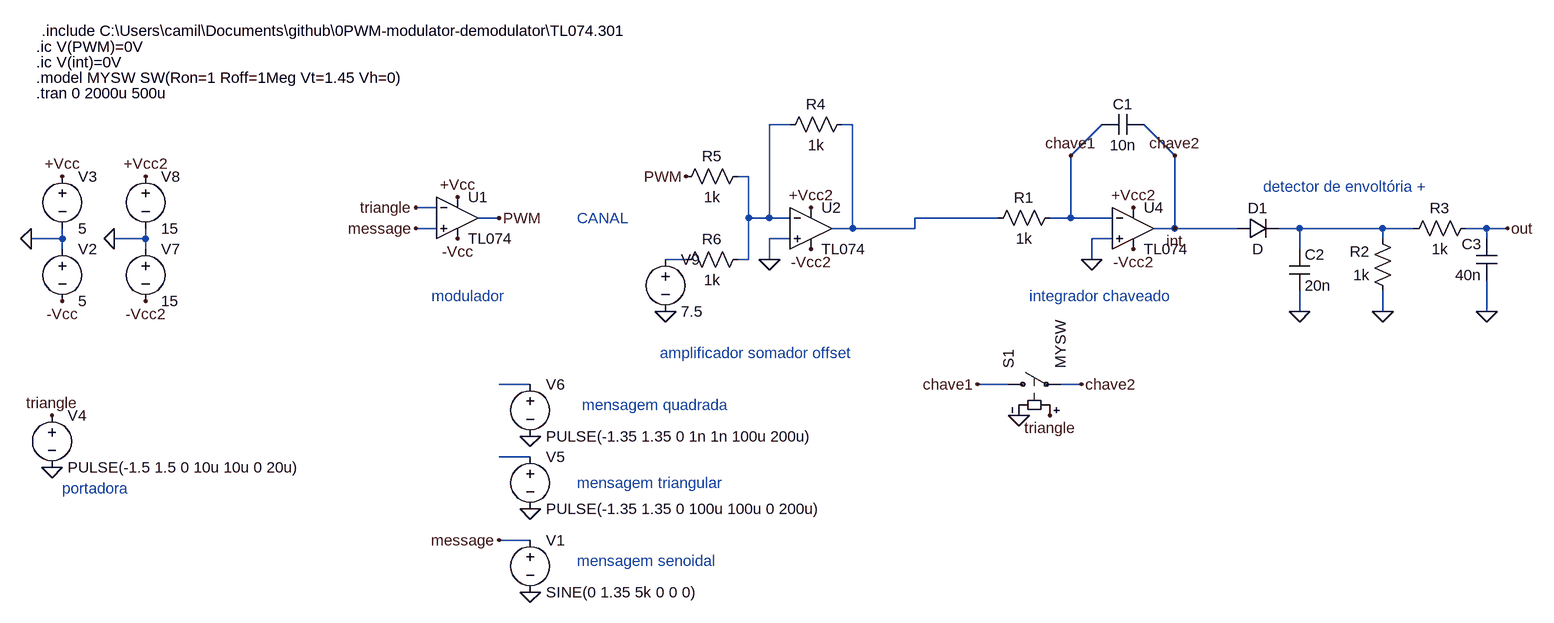
[diagram p0: schematic PWM.asc]
PWM.asc, the LTspice schematic file:
Version 4
SHEET 1 2504 684
WIRE 576 -208 544 -208
WIRE 672 -208 656 -208
WIRE 1008 -160 1056 -208
WIRE 1168 -160 1120 -208
WIRE 512 -128 496 -128
WIRE 32 -80 0 -80
WIRE 128 -64 96 -64
WIRE 512 -64 512 -128
WIRE 544 -64 544 -208
WIRE 544 -64 512 -64
WIRE 576 -64 544 -64
WIRE 896 -64 768 -64
WIRE 1008 -64 1008 -160
WIRE 1008 -64 976 -64
WIRE 1072 -64 1008 -64
WIRE 32 -48 0 -48
WIRE 672 -48 672 -208
WIRE 672 -48 640 -48
WIRE 768 -48 768 -64
WIRE 768 -48 672 -48
WIRE 1168 -48 1168 -160
WIRE 1168 -48 1136 -48
WIRE 1264 -48 1168 -48
WIRE 1360 -48 1328 -48
WIRE 1488 -48 1360 -48
WIRE 1536 -48 1488 -48
WIRE 1648 -48 1616 -48
WIRE 1680 -48 1648 -48
WIRE -544 -32 -544 -48
WIRE -544 -32 -592 -32
WIRE -416 -32 -416 -48
WIRE -416 -32 -464 -32
WIRE 576 -32 544 -32
WIRE 1072 -32 1040 -32
WIRE 1488 -32 1488 -48
WIRE 1648 -32 1648 -48
WIRE -544 -16 -544 -32
WIRE -416 -16 -416 -32
WIRE 1360 -16 1360 -48
WIRE 416 0 384 0
WIRE 512 0 512 -64
WIRE 512 0 496 0
WIRE 544 0 544 -32
WIRE 1040 0 1040 -32
WIRE 1360 80 1360 48
WIRE 1488 80 1488 48
WIRE 1648 80 1648 32
WIRE 176 192 128 192
WIRE 912 192 864 192
WIRE 1024 192 992 192
WIRE 176 304 128 304
WIRE 176 432 128 432
FLAG -592 -32 0
FLAG -544 -128 +Vcc
FLAG 64 -96 +Vcc
FLAG -544 64 -Vcc
FLAG 64 -32 -Vcc
FLAG 176 512 0
FLAG 0 -80 triangle
FLAG 128 -64 PWM
FLAG -560 320 0
FLAG -560 240 triangle
FLAG 0 -48 message
FLAG 176 384 0
FLAG 128 432 message
FLAG 1104 -80 +Vcc2
FLAG 1104 -16 -Vcc2
FLAG 1040 0 0
FLAG 416 -128 PWM
FLAG 1168 -48 int
FLAG 928 240 0
FLAG 976 240 triangle
FLAG 176 272 0
FLAG -464 -32 0
FLAG -416 -128 +Vcc2
FLAG -416 64 -Vcc2
FLAG 1360 80 0
FLAG 1488 80 0
FLAG 608 -80 +Vcc2
FLAG 608 -16 -Vcc2
FLAG 544 0 0
FLAG 1680 -48 out
FLAG 1008 -160 chave1
FLAG 1168 -160 chave2
FLAG 864 192 chave1
FLAG 1024 192 chave2
FLAG 384 80 0
FLAG 1648 80 0
SYMBOL voltage -544 -32 R0
WINDOW 123 0 0 Left 0
WINDOW 39 0 0 Left 0
SYMATTR InstName V2
SYMATTR Value 5
SYMBOL voltage -544 -144 R0
WINDOW 123 0 0 Left 0
WINDOW 39 0 0 Left 0
SYMATTR InstName V3
SYMATTR Value 5
SYMBOL voltage 176 416 R0
WINDOW 123 0 0 Left 0
WINDOW 39 0 0 Left 0
SYMATTR InstName V1
SYMATTR Value SINE(0 1.35 5k 0 0 0)
SYMBOL voltage -560 224 R0
WINDOW 123 0 0 Left 0
WINDOW 39 0 0 Left 0
SYMATTR InstName V4
SYMATTR Value PULSE(-1.5 1.5 0 10u 10u 0 20u)
SYMBOL voltage 176 288 R0
WINDOW 123 0 0 Left 0
WINDOW 39 0 0 Left 0
SYMATTR InstName V5
SYMATTR Value PULSE(-1.35 1.35 0 100u 100u 0 200u)
SYMBOL res 992 -80 R90
WINDOW 0 0 56 VBottom 2
WINDOW 3 32 56 VTop 2
SYMATTR InstName R1
SYMATTR Value 1k
SYMBOL cap 1120 -224 R90
WINDOW 0 0 32 VBottom 2
WINDOW 3 32 32 VTop 2
SYMATTR InstName C1
SYMATTR Value 10n
SYMBOL sw 896 192 R270
SYMATTR InstName S1
SYMATTR Value MYSW
SYMBOL voltage 176 176 R0
WINDOW 123 0 0 Left 0
WINDOW 39 0 0 Left 0
SYMATTR InstName V6
SYMATTR Value PULSE(-1.35 1.35 0 1n 1n 100u 200u)
SYMBOL voltage -416 -32 R0
WINDOW 123 0 0 Left 0
WINDOW 39 0 0 Left 0
SYMATTR InstName V7
SYMATTR Value 15
SYMBOL voltage -416 -144 R0
WINDOW 123 0 0 Left 0
WINDOW 39 0 0 Left 0
SYMATTR InstName V8
SYMATTR Value 15
SYMBOL res 1504 64 R180
WINDOW 0 36 76 Left 2
WINDOW 3 36 40 Left 2
SYMATTR InstName R2
SYMATTR Value 1k
SYMBOL cap 1344 -16 R0
SYMATTR InstName C2
SYMATTR Value 20n
SYMBOL diode 1264 -32 R270
WINDOW 0 32 32 VTop 2
WINDOW 3 0 32 VBottom 2
SYMATTR InstName D1
SYMBOL res 672 -224 R90
WINDOW 0 0 56 VBottom 2
WINDOW 3 32 56 VTop 2
SYMATTR InstName R4
SYMATTR Value 1k
SYMBOL res 512 -144 R90
WINDOW 0 0 56 VBottom 2
WINDOW 3 32 56 VTop 2
SYMATTR InstName R5
SYMATTR Value 1k
SYMBOL res 512 -16 R90
WINDOW 0 0 56 VBottom 2
WINDOW 3 32 56 VTop 2
SYMATTR InstName R6
SYMATTR Value 1k
SYMBOL voltage 384 -16 R0
WINDOW 123 0 0 Left 0
WINDOW 39 0 0 Left 0
SYMATTR InstName V9
SYMATTR Value 7.5
SYMBOL res 1632 -64 R90
WINDOW 0 0 56 VBottom 2
WINDOW 3 32 56 VTop 2
SYMATTR InstName R3
SYMATTR Value 1k
SYMBOL cap 1664 32 R180
WINDOW 0 24 56 Left 2
WINDOW 3 24 8 Left 2
SYMATTR InstName C3
SYMATTR Value 40n
SYMBOL OpAmps\\opamp2 64 -128 R0
SYMATTR InstName U1
SYMATTR Value TL074
SYMBOL OpAmps\\opamp2 608 -112 R0
SYMATTR InstName U2
SYMATTR Value TL074
SYMBOL OpAmps\\opamp2 1104 -112 R0
SYMATTR InstName U4
SYMATTR Value TL074
TEXT -584 -256 Left 2 !.tran 0 2000u 500u
TEXT -584 -304 Left 2 !.ic V(int)=0V
TEXT -584 -280 Left 2 !.model MYSW SW(Ron=1 Roff=1Meg Vt=1.45 Vh=0)
TEXT 24 56 Left 2 ;modulador
TEXT 248 -64 Left 2 ;CANAL
TEXT 944 56 Left 2 ;integrador chaveado
TEXT 1304 -112 Left 2 ;detector de envoltória +
TEXT -544 352 Left 2 ;portadora
TEXT 256 224 Left 2 ;mensagem quadrada
TEXT 248 344 Left 2 ;mensagem triangular
TEXT 248 464 Left 2 ;mensagem senoidal
TEXT 376 144 Left 2 ;amplificador somador offset
TEXT -584 -328 Left 2 !.ic V(PWM)=0V
TEXT -576 -352 Left 2 !.include C:\\Users\\camil\\Documents\\github\\0PWM-modulator-demodulator\\TL074.301

The netlist it stands for:
* PWM.asc
V2 0 -Vcc 5
V3 +Vcc 0 5
V1 message 0 SINE(0 1.35 5k 0 0 0)
V4 triangle 0 PULSE(-1.5 1.5 0 10u 10u 0 20u)
V5 N006 0 PULSE(-1.35 1.35 0 100u 100u 0 200u)
R1 chave1 N002 1k
C1 chave2 chave1 10n
S1 chave1 chave2 triangle 0 MYSW
V6 N005 0 PULSE(-1.35 1.35 0 1n 1n 100u 200u)
V7 0 -Vcc2 15
V8 +Vcc2 0 15
R2 0 N003 1k
C2 N003 0 20n
D1 chave2 N003 D
R4 N002 N001 1k
R5 N001 PWM 1k
R6 N001 N004 1k
V9 N004 0 7.5
R3 out N003 1k
C3 0 out 40n
XU1 message triangle +Vcc -Vcc PWM TL074  ; pins In+ In- V+ V- OUT
XU2 0 N001 +Vcc2 -Vcc2 N002 TL074  ; pins In+ In- V+ V- OUT
XU4 0 chave1 +Vcc2 -Vcc2 chave2 TL074  ; pins In+ In- V+ V- OUT
.model D D
.lib standard.dio
.tran 0 2000u 500u
.ic V(int)=0V
.model MYSW SW(Ron=1 Roff=1Meg Vt=1.45 Vh=0)
* modulador
* CANAL
* integrador chaveado
* detector de envoltória +
* portadora
* mensagem quadrada
* mensagem triangular
* mensagem senoidal
* amplificador somador offset
.ic V(PWM)=0V
.include C:\Users\camil\Documents\github\0PWM-modulator-demodulator\TL074.301
.backanno
.end